# Altium schematic sheet Master MicroController Port K.SchDoc: Master Micro Controller Port K Pin Out
size A4; DocumentNumber: 25; SheetNumber: 25; SheetTotal: 54
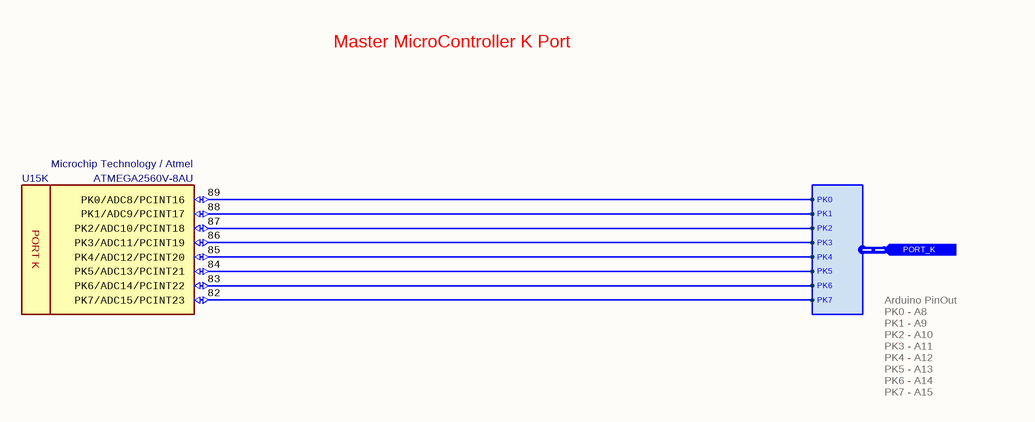
[diagram p0: Master MicroController Port K.SchDoc]

## Parts
U15  Manufacturer_Part_Number: ATMEGA2560V-8AU  Manufacturer_Name: Microchip Technology / Atmel  [TQFP100]  (hidden comment: 8-bit MicroController)  (part K of 15)

## Ports
PORT_K (in, harness PORT_K)

## Harnesses
PORT_K: PK0, PK1, PK2, PK3, PK4, PK5, PK7, PK6

## Nets
NetU15_82: U15.82(PK7/ADC15/PCINT23) ; port PORT_K.PK7
NetU15_83: U15.83(PK6/ADC14/PCINT22) ; port PORT_K.PK6
NetU15_84: U15.84(PK5/ADC13/PCINT21) ; port PORT_K.PK5
NetU15_85: U15.85(PK4/ADC12/PCINT20) ; port PORT_K.PK4
NetU15_86: U15.86(PK3/ADC11/PCINT19) ; port PORT_K.PK3
NetU15_87: U15.87(PK2/ADC10/PCINT18) ; port PORT_K.PK2
NetU15_88: U15.88(PK1/ADC9/PCINT17) ; port PORT_K.PK1
NetU15_89: U15.89(PK0/ADC8/PCINT16) ; port PORT_K.PK0

## Notes on the sheet
- Master MicroController K Port
- Arduino PinOut
  PK0 - A8
  PK1 - A9
  PK2 - A10
  PK3 - A11
  PK4 - A12
  PK5 - A13
  PK6 - A14
  PK7 - A15
- Title
- Size:
- Date:
- A4
- Number:
- Time:
- Revision:
- Sheet
- of
- File:
- (in symbol IC - ATMEGA2560V-8AU, part K) PORT K

## Library data of the parts
U15 = IC - ATMEGA2560V-8AU: 8-bit Microcontrollers - MCU 256kB Flash 4kB EEPROM 86 I/O Pins; Supply Voltage - Min: 2V7; Supply Voltage - Max: 5.5V; Height: 1mm; Mouser_Part_Number: 556-ATMEGA2560V8AU; ComponentLink1Description: DataSheet; ComponentLink1URL: https://eu.mouser.com/datasheet/2/268/Atmel-2549-8-bit-AVR-Microcontroller-ATmega640-128-1315286.pdf; ROHS: Yes; Minimum Operating Temperature: -40; Maximum Operating Temperature: +85; ComponentLink2Description: Mouser; ComponentLink2URL: https://eu.mouser.com/ProductDetail/Microchip-Technology-Atmel/ATMEGA2560V-8AU?qs=sGAEpiMZZMutXGli8Ay4kKlCYcvZUWqJYdtgGFyqFT8%3D; Supplier 1: Mouser; Supplier 2: Arrow; Supplier 3: Farnell; Supplier 4: Newark; Supplier 5: Digi-Key; Supplier Part Number 1: 556-ATMEGA2560V8AU; Supplier Part Number 2: ATMEGA2560V-8AU; Supplier Part Number 3: 1288331; Supplier Part Number 4: 68T2784; Supplier Part Number 5: ATMEGA2560V-8AU-ND; Case: TQFP-100